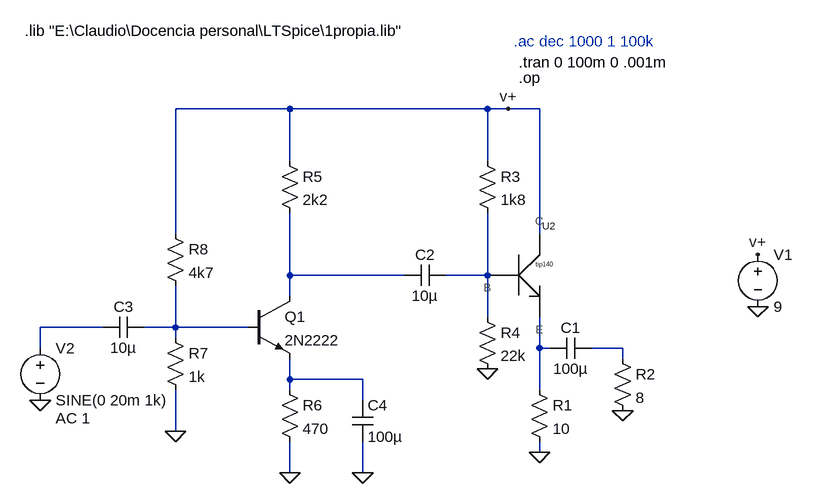
[diagram p0: schematic audioclasea2.asc]
audioclasea2.asc, the LTspice schematic file:
Version 4
SHEET 1 1316 680
WIRE 288 -176 112 -176
WIRE 592 -176 288 -176
WIRE 624 -176 592 -176
WIRE 672 -176 624 -176
WIRE 288 -96 288 -176
WIRE 592 -96 592 -176
WIRE 112 16 112 -176
WIRE 672 16 672 -176
WIRE 288 80 288 -16
WIRE 464 80 288 80
WIRE 592 80 592 -16
WIRE 592 80 528 80
WIRE 288 112 288 80
WIRE 592 144 592 80
WIRE 0 160 -96 160
WIRE 112 160 112 96
WIRE 112 160 64 160
WIRE 224 160 112 160
WIRE 112 176 112 160
WIRE -96 192 -96 160
WIRE 672 192 672 144
WIRE 688 192 672 192
WIRE 800 192 752 192
WIRE 800 208 800 192
WIRE 288 240 288 208
WIRE 400 240 288 240
WIRE 288 256 288 240
WIRE 672 256 672 192
WIRE 400 272 400 240
WIRE 112 320 112 256
WIRE 672 352 672 336
WIRE 288 384 288 336
WIRE 400 384 400 336
FLAG 1008 128 0
FLAG 672 352 0
FLAG 800 288 0
FLAG 592 224 0
FLAG 1008 48 v+
FLAG 624 -176 v+
FLAG 288 384 0
FLAG 112 320 0
FLAG -96 272 0
FLAG 400 384 0
DATAFLAG 576 80 ""
DATAFLAG 672 192 ""
DATAFLAG 304 80 ""
DATAFLAG 160 160 ""
DATAFLAG 288 240 ""
SYMBOL Propia\\Darlington\ npn 640 80 R0
SYMATTR Value tip140
SYMATTR InstName U2
SYMBOL voltage 1008 32 R0
WINDOW 123 0 0 Left 0
WINDOW 39 0 0 Left 0
SYMATTR InstName V1
SYMATTR Value 9
SYMBOL res 656 240 R0
SYMATTR InstName R1
SYMATTR Value 10
SYMBOL cap 752 176 R90
WINDOW 0 0 32 VBottom 2
WINDOW 3 32 32 VTop 2
SYMATTR InstName C1
SYMATTR Value 100µ
SYMBOL res 784 192 R0
SYMATTR InstName R2
SYMATTR Value 8
SYMBOL res 576 -112 R0
SYMATTR InstName R3
SYMATTR Value 1k8
SYMBOL res 576 128 R0
SYMATTR InstName R4
SYMATTR Value 22k
SYMBOL cap 528 64 R90
WINDOW 0 0 32 VBottom 2
WINDOW 3 32 32 VTop 2
SYMATTR InstName C2
SYMATTR Value 10µ
SYMBOL npn 224 112 R0
SYMATTR InstName Q1
SYMATTR Value 2N2222
SYMBOL res 272 -112 R0
SYMATTR InstName R5
SYMATTR Value 2k2
SYMBOL res 272 240 R0
SYMATTR InstName R6
SYMATTR Value 470
SYMBOL res 96 160 R0
SYMATTR InstName R7
SYMATTR Value 1k
SYMBOL res 96 0 R0
SYMATTR InstName R8
SYMATTR Value 4k7
SYMBOL cap 64 144 R90
WINDOW 0 0 32 VBottom 2
WINDOW 3 32 32 VTop 2
SYMATTR InstName C3
SYMATTR Value 10µ
SYMBOL voltage -96 176 R0
WINDOW 123 24 124 Left 2
WINDOW 39 0 0 Left 0
SYMATTR Value2 AC 1
SYMATTR InstName V2
SYMATTR Value SINE(0 20m 1k)
SYMBOL cap 384 272 R0
SYMATTR InstName C4
SYMATTR Value 100µ
TEXT 640 -224 Left 2 !.op
TEXT -120 -296 Left 2 !.lib "E:\\Claudio\\Docencia personal\\LTSpice\\1propia.lib"
TEXT 640 -248 Left 2 !.tran 0 100m 0 .001m
TEXT 632 -280 Left 2 ;.ac dec 1000 1 100k

The netlist it stands for:
* audioclasea2.asc
XU2 v+ N002 N005 tip140  ; pins C B E
V1 v+ 0 9
R1 N005 0 10
C1 N006 N005 100µ
R2 N006 0 8
R3 v+ N002 1k8
R4 N002 0 22k
C2 N002 N001 10µ
Q1 N001 N004 N007 0 2N2222
R5 v+ N001 2k2
R6 N007 0 470
R7 N004 0 1k
R8 v+ N004 4k7
C3 N004 N003 10µ
V2 N003 0 SINE(0 20m 1k) AC 1
C4 N007 0 100µ
.model NPN NPN
.model PNP PNP
.lib standard.bjt
.op
.lib "E:\Claudio\Docencia personal\LTSpice\1propia.lib"
.tran 0 100m 0 .001m
* .ac dec 1000 1 100k
.backanno
.end